# Altium schematic sheet DCMTR_ENC.SchDoc
size Letter; SheetNumber: 4; SheetTotal: 11; SPICEModelCacheWFUJGXDS: <root> / <DocumentId>WFUJGXDS</DocumentId> / </root>
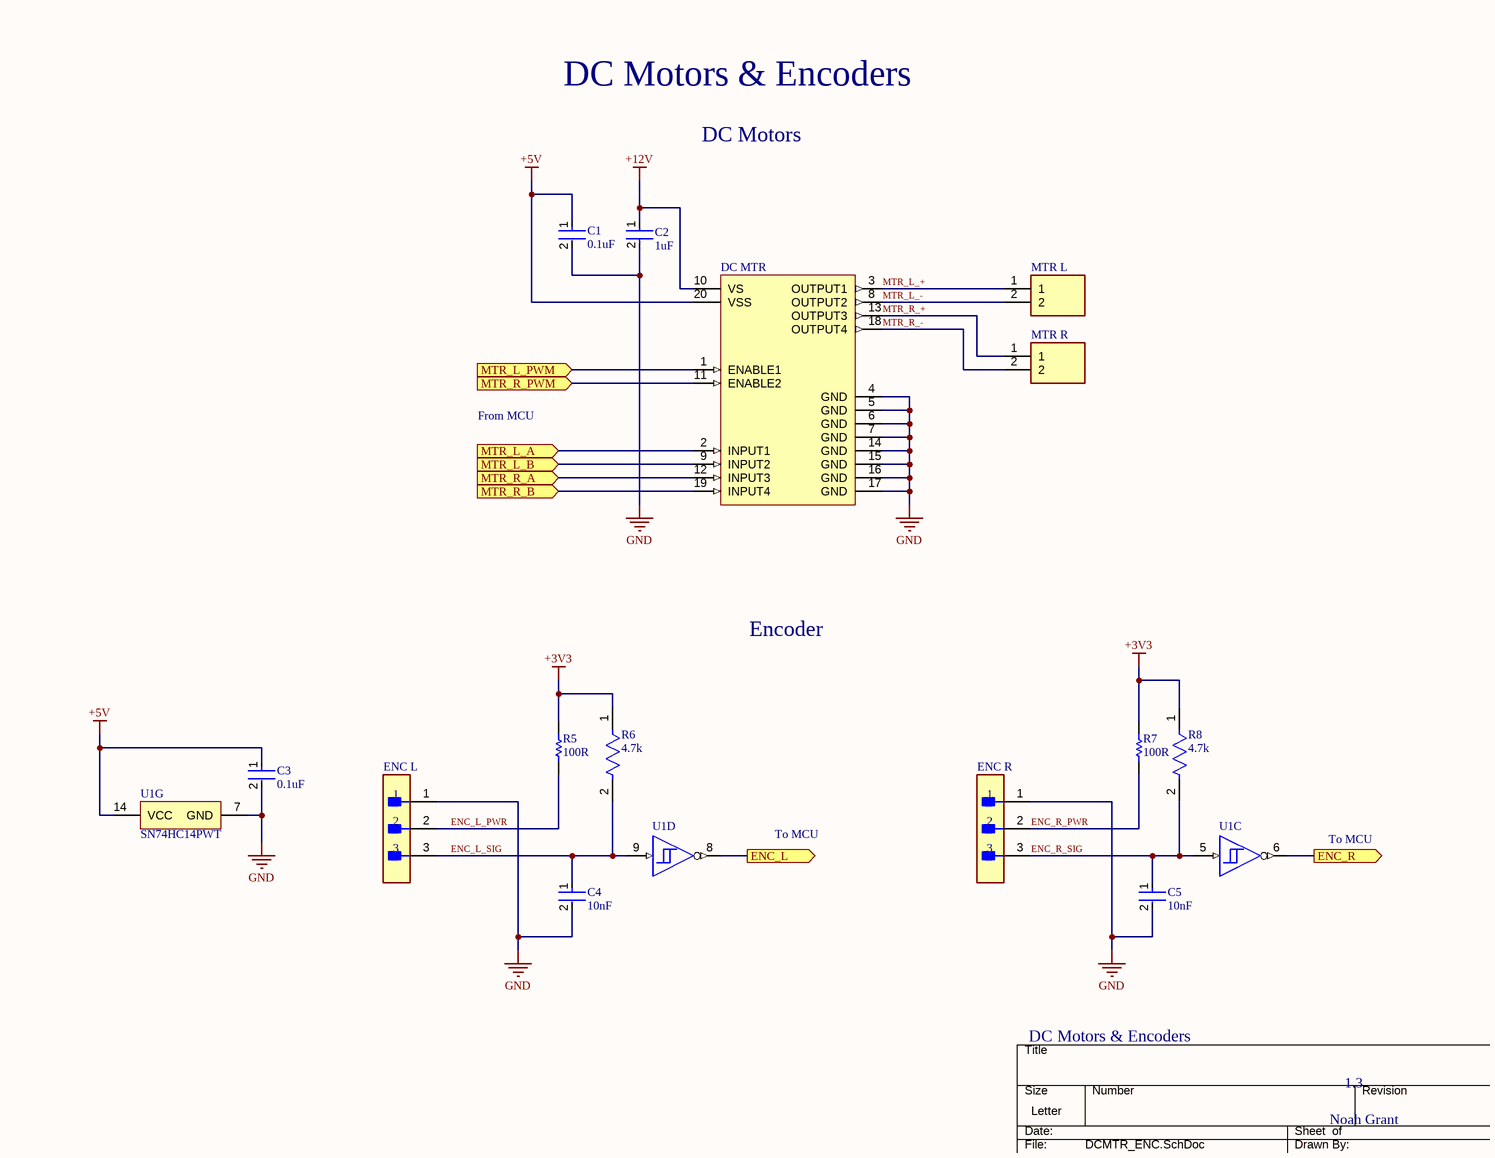
[diagram p0: DCMTR_ENC.SchDoc]

## Parts
C1  0.1uF  [FP-CC0603-DA-MFG]
C2  1uF  [FP-C1608-080-0_1-MFG]
C3  0.1uF  [FP-CC0603-DA-MFG]
C4  10nF  [FP-CC0603-DA-MFG]
C5  10nF  [FP-CC0603-DA-MFG]
DC_MTR  L293DD  [STM-SOIC-20_M]  (value not drawn)
ENC_L  22-11-2032  [FP-22-11-2032-MFG]  (value not drawn)
ENC_R  22-11-2032  [FP-22-11-2032-MFG]  (value not drawn)
MTR_L  22-11-2022  [HDRV2W75P0X254_1X2_493X635X1091P]  (value not drawn)
MTR_R  22-11-2022  [HDRV2W75P0X254_1X2_493X635X1091P]  (value not drawn)
R5  100R  [RESC1609X50X30ML8T20]
R6  4.7k  [FP-CRCW0603-e3-IPC_A]
R7  100R  [RESC1609X50X30ML8T20]
R8  4.7k  [FP-CRCW0603-e3-IPC_A]
U1  SN74HC14PWT  [PW0014A_M]  (value not drawn)  (parts C,D,G of 7)

## Ports
ENC_L (out, see Top_Sheet[1B], Debug[1B], Nucleo[2C]), ENC_R (out, see Top_Sheet[1B], Debug[1B], Nucleo[2C]), MTR_L_A (in, see Top_Sheet[1A], Debug[1B], Nucleo[1B]), MTR_L_B (in, see Top_Sheet[1B], Debug[1B], Nucleo[1C]), MTR_L_PWM (in, see Top_Sheet[1A], Debug[1B], Nucleo[1B]), MTR_R_A (in, see Top_Sheet[1B], Debug[1B], Nucleo[4B]), MTR_R_B (in, see Top_Sheet[1B], Debug[1B], Nucleo[3B]), MTR_R_PWM (in, see Top_Sheet[1A], Debug[1B], Nucleo[2B])

## Nets
+3V3: R5.2 R6.1 R7.2 R8.1
+5V: C1.1 C3.1 DC_MTR.20(VSS) U1.14(VCC)
+12V: C2.1 DC_MTR.10(VS)
GND: C1.2 C2.2 C3.2 C4.2 C5.2 DC_MTR.4(GND) DC_MTR.5(GND) DC_MTR.6(GND) DC_MTR.7(GND) DC_MTR.14(GND) DC_MTR.15(GND) DC_MTR.16(GND) DC_MTR.17(GND) ENC_L.1 ENC_R.1 U1.7(GND)
ENC_L: U1.8(~{4Y}) ; port ENC_L
ENC_L_PWR: ENC_L.2 R5.1
ENC_L_SIG: C4.1 ENC_L.3 R6.2 U1.9(4A)
ENC_R: U1.6(~{3Y}) ; port ENC_R
ENC_R_PWR: ENC_R.2 R7.1
ENC_R_SIG: C5.1 ENC_R.3 R8.2 U1.5(3A)
MTR_L_+: DC_MTR.3(OUTPUT1) MTR_L.1
MTR_L_-: DC_MTR.8(OUTPUT2) MTR_L.2
MTR_L_A: DC_MTR.2(INPUT1) ; port MTR_L_A
MTR_L_B: DC_MTR.9(INPUT2) ; port MTR_L_B
MTR_L_PWM: DC_MTR.1(ENABLE1) ; port MTR_L_PWM
MTR_R_+: DC_MTR.13(OUTPUT3) MTR_R.1
MTR_R_-: DC_MTR.18(OUTPUT4) MTR_R.2
MTR_R_A: DC_MTR.12(INPUT3) ; port MTR_R_A
MTR_R_B: DC_MTR.19(INPUT4) ; port MTR_R_B
MTR_R_PWM: DC_MTR.11(ENABLE2) ; port MTR_R_PWM

## Notes on the sheet
- DC Motors & Encoders
- DC Motors
- From MCU
- Encoder
- To MCU
- 1.3
- Noah Grant
- DWG. NO.
- REV.
- SHT.
- THIS DOCUMENT AND THE DATA DISCLOSED HEREIN OR HEREWITH IS THE PROPERTY OF ALTIUM LIMITED AND MAY BE FREELY DISTRIBUTED IN WHOLE. NO RIGHTS ARE RESERVED OR EXPRESS OR IMPLIED WARANTEE GIVEN.
- REVISION
- DESCRIPTION
- DATE
- APPROVED
- ENG:
- APPROVALS
- PROJECT
- DSN:
- CHK:
- REFERENCE DOCUMENTS
- PROJECT REVISION:
- TITLE
- DOCUMENT REVISION:
- DESIGN ITEM:
- BOM:
- FAB DWG:
- PCB DWG:
- ASSY DWG:
- SCALE:
- SIZE
- B
- CAGE CODE
- FILE NAME
- DWG NO.
- SHEET
- OF
- REV

## Library data of the parts
C1 C3 = CMP-03422-000468-1: CAP CER 0.1UF 50V X7R 0603; Manufacturer: YAGEO; Manufacturer Part Number: CC0603KPX7R9BB104; Temperature Coefficient: 15%; Capacitance: 100 nF; Material: Ceramic; Value: 100 nF; Tolerance: 0.1; Device Class L1: Passive Components; Temperature Range High: +125°C; ComponentLink2Description: Datasheet; Temperature Characteristic: X7R; Octopart: https://octopart.com/cc0603kpx7r9bb104-yageo-12885113; Height: 0.9mm; Mouser Description: Multilayer Ceramic Capacitors MLCC - SMD/SMT 100nF 50V X7R 10%; Device Class L3: Ceramic Capacitors; Voltage Rating: 50 V; Device Class L2: Capacitors; ComponentLink2URL: http://www.yageo.com/documents/recent/UPY-GPHC_X7R_6.3V-to-50V_18.pdf; Package: CC0603-DA; Automotive: No; Voltage: 50 V; RoHS: TRUE; Lead Free: Yes; Digikey Description: CAP CER 0.1UF 50V X7R 0603; Footprint Url: http://www.yageo.com/exep/pages/download/literatures/UPY-C_GEN_24.pdf; Temperature Range Low: -55°C; Temperature: -55°C to +125°C; Category: Cap
C2 = CMP-08246-006763-1: Multilayer Ceramic Capacitors 1μF ±10% 25V X6S SMD 0603; Dielectric: X6S; Capacitance: 1uF; Construction: Flat; Case/Package: 0603; Tolerance: 10%; Dielectric Material: Ceramic; Lead Free: Lead Free; Series: C; Case Code (Metric): 1608; Width: 0.031inch; Weight: 7.1E-05oz; Voltage Rating: 25V; Depth: 0.8mm; Packaging: Tape and Reel; Termination: SMD/SMT; Voltage Rating (DC): 25V; Mount: Surface Mount; Height: 0.8mm; Max Operating Temperature: 105°C; Min Operating Temperature: -55°C; Case Code (Imperial): 0603; Package Quantity: 4000; Length: 1.6mm; Thickness: 0.035inch; RoHS Compliant: Yes
C4 C5 = CMP-2100-03600-2: CAP CER 10000PF 50V X7R 0603; Manufacturer Part Number: CC0603KRX7R9BB103; Manufacturer: YAGEO; Tolerance: 0.1; Material: Ceramic; Temperature Coefficient: 15%; Mouser Description: Multilayer Ceramic Capacitor, CC Series, 0.01 - F, - 10%, X7R, 50 V, 0603 [1608 Metric]; Digikey Description: CAP CER 10000PF 50V X7R 0603; Height: 0.9mm; Category: Cap; Temperature Characteristic: X7R; Footprint Url: http://www.yageo.com/exep/pages/download/literatures/UPY-C_GEN_24.pdf; Lead Free: Yes; Voltage Rating: 50 V; Temperature: -55°C to +125°C; Device Class L3: Ceramic Capacitors; ComponentLink2Description: Datasheet; Voltage: 50 V; Package: CC0603-DA; Octopart: https://octopart.com/cc0603krx7r9bb103-yageo-192938; Automotive: No; Temperature Range High: +125°C; Temperature Range Low: -55°C; Value: 10 nF; RoHS: TRUE; Device Class L1: Passive Components; ComponentLink2URL: http://www.yageo.com/documents/recent/UPY-GPHC_X7R_6.3V-to-50V_18.pdf; Device Class L2: Capacitors; Capacitance: 10 nF
DC_MTR = CMP-1771-00003-1: Push-Pull Four Channel Driver with Diodes, 4.5 to 36 V, 20-Pin SOIC, RoHS, Tube; Voltage Rating: 50 V; Power Rating: 100 mW; Case\Package: 0603; Resistance: 15 kohm; Tolerance: 1%; REACH SVHC: Unknown; Case Code (Imperial): 0603; ComponentLink2Description: Datasheet; ComponentLink2URL: http://www.st.com/content/ccc/resource/technical/document/datasheet/04/ac/22/f9/20/5d/43/a1/CD00000059.pdf/files/CD00000059.pdf/jcr:content/translations/en.CD00000059.pdf; Max Operating Temperature: 155 degC; Width: 0.8 mm; ComponentLink1URL: http://www.st.com/; ComponentLink1Description: Manufacturer URL; Length: 1.6 mm; Package Quantity: 5000; RoHSCompliant: true; Height: 0.45 mm; Mount: Surface Mount; PackageDescription: 20-Pin Small Outline Integrated Circuit, Body 12.8 x 7.5 mm, Pitch 1.27 mm; PackageReference: SOIC-20; Packaging: Tape and Reel; Min Operating Temperature: -55 degC; Case Code (Metric): 1608; DatasheetVersion: Jul-03
ENC_L ENC_R = CMP-04776-000113-1: CONN HEADER VERT 3POS 2.54MM; Manufacturer: Molex; Number Of Contacts: 3; Voltage Rating: 500V; Conn Gender: Male; Current Rating: 4A; Conn Orientation: Vertical; Device Class L2: Headers and Wire Housings; Number Of Rows: 1; Temperature Range High: +80°C; RoHS: TRUE; ComponentLink2URL: https://www.molex.com/webdocs/datasheets/pdf/en-us/0022112032_PCB_HEADERS.pdf; Manufacturer Part Number: 22-11-2032; Device Class L3: unset; Automotive: No; Temperature: -40°C to +80°C; Temperature Range Low: -40°C; Lead Free: Yes; Pitch: 2.54mm; Footprint Url: https://www.molex.com/pdm_docs/sd/022112032_sd.pdf; Digikey Description: CONN HEADER VERT 3POS 2.54MM; Contact Material: Gold,Nickel; Octopart: https://octopart.com/22-11-2032-molex-10085; Height: 10.91mm; Mouser Description: KK® 254 Solid Header, Vertical, with Friction Lock, 3 Circuits, Gold (Au) Plating; Package: 22-11-2032; Device Class L1: Connectors; Mounting Type: Through Hole; ComponentLink2Description: Datasheet; Category: Conn
MTR_L MTR_R = 22-11-2022: Connector; Manufacturer_Name: Molex; Datasheet Link: https://www.molex.com/pdm_docs/sd/022112022_sd.pdf; Height: 10.91mm; Manufacturer_Part_Number: 22-11-2022
R5 R7 = CMP-2000-03824-5: Chip Resistor, 100 Ohm, +/- 1%, 100 mW,-55 to 155 degC, 0603 (1608 Metric), RoHS, Tape and Ree; Manufacturer: Vishay Semiconductor; ComponentLink2URL: http://www.vishay.com/docs/20035/dcrcwe3.pdf; ComponentLink1URL: http://www.vishay.com/; Mounting Technology: Surface Mount; ComponentLink1Description: Manufacturer URL; ComponentLink2Description: Datasheet; PackageDescription: 2-Pin Surface Mount Device, Body 1.575 x 0.85 mm; PackageReference: 0603; DatasheetVersion: 06/2012
R6 R8 = CMP-1666-00019-3: RES Thick Film, 4.7kΩ, 1%, 0.1W, 100ppm/°C, 0603; Resistance: 4.7kR; Voltage Rating: 75V; Power Rating: 100mW; Case Code (Metric): 1608; Military Standard: Not; Packaging: Tape and Reel; Termination: SMD/SMT; Temperature Coefficient: 100ppm/°C; Lead Free: Lead Free; Length: 1.55mm; Width: 0.85mm; Height: 0.45mm; Depth: 0.85mm; Weight: 7.1E-05oz; Case Code (Imperial): 0603; Contact Plating: Tin; Case/Package: 0603; Max Operating Temperature: 155°C; Mount: Surface Mount; Tolerance: 1%; Min Operating Temperature: -55°C; Package Quantity: 5000; Voltage Rating (DC): 75V; Composition: Thick Film
U1 = CMP-1615-00108-4: Hex Schmitt-Trigger Inverters, PW0014A, SMALL T&R; Manufacturer: Texas Instruments; F @ Nom Voltage(Max)(Mhz): 20; Input Type: CMOS; VCC(Min)(V): 2; Bits(#): 6; Output Drive (IOL/IOH)(Max)(mA): -4/4; Technology Family: HC; Rating: Catalog; Voltage(Nom)(V): 5; ICC @ Nom Voltage(Max)(mA): 0.02; Schmitt Trigger: Yes; tpd @ Nom Voltage(Max)(ns): 31; Operating Temperature Range(C): -40 to 85; Output Type: CMOS; DatasheetVersion: SCLS085G; Generic Part Number: SN74HC14; VCC(Max)(V): 6; Code_JEDEC: MO-153; PackageReference: PW0014A